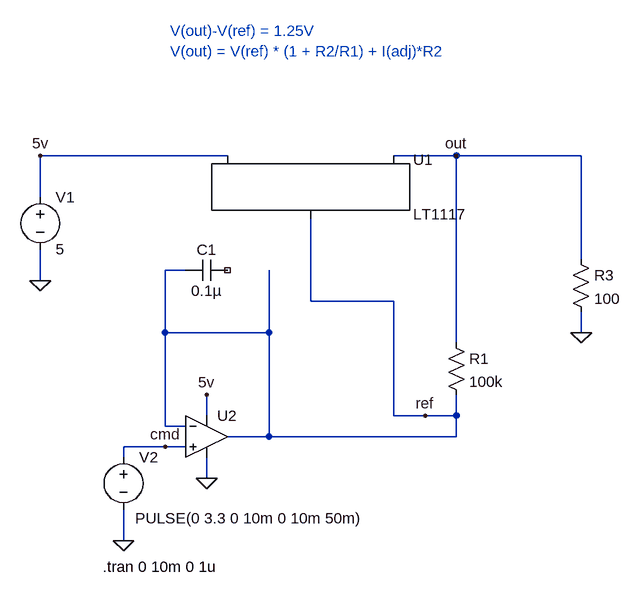
[diagram p0: schematic lt1117_sim.asc]
lt1117_sim.asc, the LTspice schematic file:
Version 4
SHEET 1 880 1124
WIRE 96 176 -192 176
WIRE 448 176 352 176
WIRE 640 176 448 176
WIRE -192 240 -192 176
WIRE 640 336 640 176
WIRE 32 352 0 352
WIRE -192 368 -192 320
WIRE 224 400 224 272
WIRE 352 400 224 400
WIRE 0 448 0 352
WIRE 160 448 160 352
WIRE 160 448 0 448
WIRE 640 448 640 416
WIRE 448 464 448 176
WIRE 64 576 64 544
WIRE 352 576 352 400
WIRE 400 576 352 576
WIRE 448 576 448 544
WIRE 448 576 400 576
WIRE 0 592 0 448
WIRE 32 592 0 592
WIRE 160 608 160 448
WIRE 160 608 96 608
WIRE 448 608 448 576
WIRE 448 608 160 608
WIRE 0 624 -64 624
WIRE 32 624 0 624
WIRE -64 640 -64 624
WIRE 64 672 64 640
WIRE -64 768 -64 720
FLAG -192 368 0
FLAG 64 544 5v
FLAG 64 672 0
FLAG -64 768 0
FLAG 448 176 out
FLAG 400 576 ref
FLAG 0 624 cmd
FLAG 640 448 0
FLAG -192 176 5v
SYMBOL PowerProducts\\LT1117 224 176 R0
SYMATTR InstName U1
SYMBOL voltage -192 224 R0
SYMATTR InstName V1
SYMATTR Value 5
SYMBOL res 432 448 R0
SYMATTR InstName R1
SYMATTR Value 100k
SYMBOL cap 96 336 R90
WINDOW 0 0 32 VBottom 2
WINDOW 3 32 32 VTop 2
SYMATTR InstName C1
SYMATTR Value 0.1µ
SYMBOL voltage -64 624 R0
WINDOW 3 18 110 Left 2
WINDOW 123 0 0 Left 0
WINDOW 39 0 0 Left 0
SYMATTR Value PULSE(0 3.3 0 10m 0 10m 50m)
SYMATTR InstName V2
SYMBOL OpAmps\\UniversalOpAmp2 64 608 R0
SYMATTR InstName U2
SYMBOL res 624 320 R0
SYMATTR InstName R3
SYMATTR Value 100
TEXT -96 808 Left 2 !.tran 0 10m 0 1u
TEXT 8 -16 Left 2 ;V(out)-V(ref) = 1.25V\nV(out) = V(ref) * (1 + R2/R1) + I(adj)*R2

The netlist it stands for:
* lt1117_sim.asc
XU1 ref out 5v LT1117
V1 5v 0 5
R1 out ref 100k
C1 NC_01 ref 0.1µ
V2 cmd 0 PULSE(0 3.3 0 10m 0 10m 50m)
XU2 cmd ref 5v 0 ref level2 Avol=1Meg GBW=10Meg Slew=10Meg Ilimit=25m Rail=0 Vos=0 En=0 Enk=0 In=0 Ink=0 Rin=500Meg  ; pins In+ In- V+ V- OUT
R3 out 0 100
.tran 0 10m 0 1u
* V(out)-V(ref) = 1.25V
* V(out) = V(ref) * (1 + R2/R1) + I(adj)*R2
.lib LT1117.lib
.lib UniversalOpAmp2.lib
.backanno
.end